# EAGLE design Main.v0.2 (EAGLE 7.4.0)

## Sheet 1 of 2
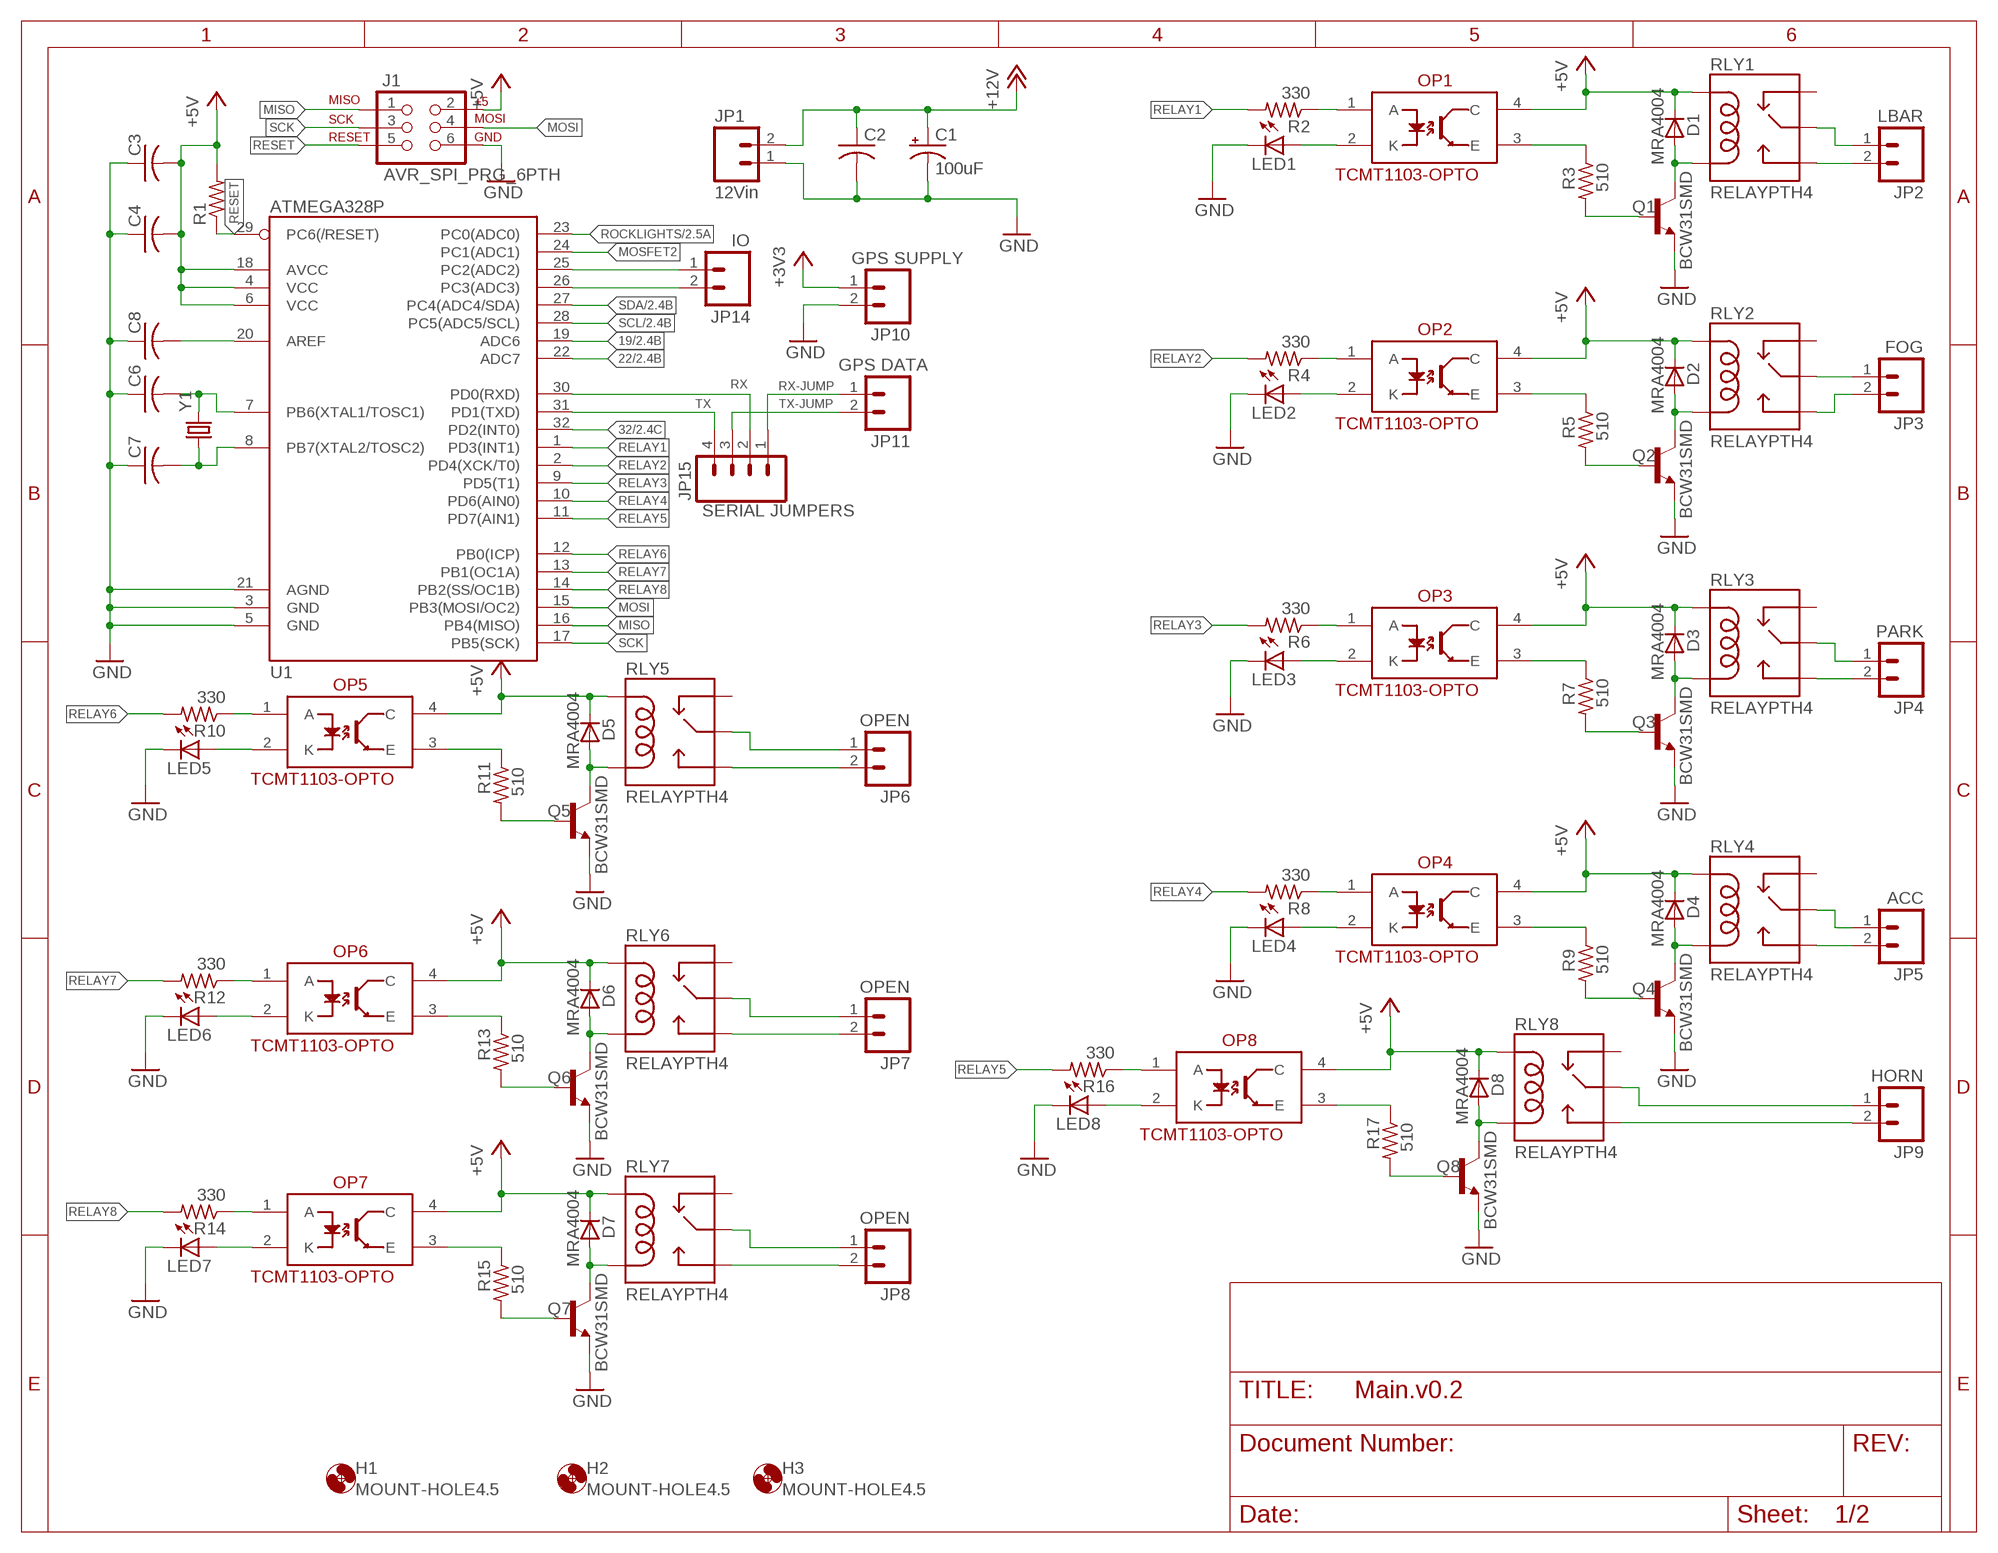
[diagram p0: schematic, sheet 1]

### Parts
C1  100uF  CPOL-USF  [PANASONIC_F]
C2  C-USC1206  [C1206]
C3  C-USC1206  [C1206]
C4  C-USC1206  [C1206]
C6  C-USC1206  [C1206]
C7  C-USC1206  [C1206]
C8  C-USC1206  [C1206]
D1  MRA4004  DIODESMA-ALT  [SMA-DIODE_ALT]
D2  MRA4004  DIODESMA-ALT  [SMA-DIODE_ALT]
D3  MRA4004  DIODESMA-ALT  [SMA-DIODE_ALT]
D4  MRA4004  DIODESMA-ALT  [SMA-DIODE_ALT]
D5  MRA4004  DIODESMA-ALT  [SMA-DIODE_ALT]
D6  MRA4004  DIODESMA-ALT  [SMA-DIODE_ALT]
D7  MRA4004  DIODESMA-ALT  [SMA-DIODE_ALT]
D8  MRA4004  DIODESMA-ALT  [SMA-DIODE_ALT]
H1  MOUNT-HOLE4.5  [4,5]
H2  MOUNT-HOLE4.5  [4,5]
H3  MOUNT-HOLE4.5  [4,5]
J1  AVR_SPI_PRG_6PTH  [2X3]
JP1  12Vin  M023.5MM  [SCREWTERMINAL-3.5MM-2]
JP2  LBAR  M023.5MM  [SCREWTERMINAL-3.5MM-2]
JP3  FOG  M023.5MM  [SCREWTERMINAL-3.5MM-2]
JP4  PARK  M023.5MM  [SCREWTERMINAL-3.5MM-2]
JP5  ACC  M023.5MM  [SCREWTERMINAL-3.5MM-2]
JP6  OPEN  M023.5MM  [SCREWTERMINAL-3.5MM-2]
JP7  OPEN  M023.5MM  [SCREWTERMINAL-3.5MM-2]
JP8  OPEN  M023.5MM  [SCREWTERMINAL-3.5MM-2]
JP9  HORN  M023.5MM  [SCREWTERMINAL-3.5MM-2]
JP10  GPS SUPPLY  M023.5MM  [SCREWTERMINAL-3.5MM-2]
JP11  GPS DATA  M023.5MM  [SCREWTERMINAL-3.5MM-2]
JP14  IO  M023.5MM  [SCREWTERMINAL-3.5MM-2]
JP15  SERIAL JUMPERS  M04PTH  [1X04]
LED1  LED1206  [LED-1206]
LED2  LED1206  [LED-1206]
LED3  LED1206  [LED-1206]
LED4  LED1206  [LED-1206]
LED5  LED1206  [LED-1206]
LED6  LED1206  [LED-1206]
LED7  LED1206  [LED-1206]
LED8  LED1206  [LED-1206]
OP1  TCMT1103-OPTO  [SSOP-4]
OP2  TCMT1103-OPTO  [SSOP-4]
OP3  TCMT1103-OPTO  [SSOP-4]
OP4  TCMT1103-OPTO  [SSOP-4]
OP5  TCMT1103-OPTO  [SSOP-4]
OP6  TCMT1103-OPTO  [SSOP-4]
OP7  TCMT1103-OPTO  [SSOP-4]
OP8  TCMT1103-OPTO  [SSOP-4]
Q1  BCW31SMD  [SOT23-BEC]
Q2  BCW31SMD  [SOT23-BEC]
Q3  BCW31SMD  [SOT23-BEC]
Q4  BCW31SMD  [SOT23-BEC]
Q5  BCW31SMD  [SOT23-BEC]
Q6  BCW31SMD  [SOT23-BEC]
Q7  BCW31SMD  [SOT23-BEC]
Q8  BCW31SMD  [SOT23-BEC]
R1  R-US_R1206  [R1206]
R2  330  R-US_R1206  [R1206]
R3  510  R-US_R1206  [R1206]
R4  330  R-US_R1206  [R1206]
R5  510  R-US_R1206  [R1206]
R6  330  R-US_R1206  [R1206]
R7  510  R-US_R1206  [R1206]
R8  330  R-US_R1206  [R1206]
R9  510  R-US_R1206  [R1206]
R10  330  R-US_R1206  [R1206]
R11  510  R-US_R1206  [R1206]
R12  330  R-US_R1206  [R1206]
R13  510  R-US_R1206  [R1206]
R14  330  R-US_R1206  [R1206]
R15  510  R-US_R1206  [R1206]
R16  330  R-US_R1206  [R1206]
R17  510  R-US_R1206  [R1206]
RLY1  RELAYPTH4  [RELAY-JZC]
RLY2  RELAYPTH4  [RELAY-JZC]
RLY3  RELAYPTH4  [RELAY-JZC]
RLY4  RELAYPTH4  [RELAY-JZC]
RLY5  RELAYPTH4  [RELAY-JZC]
RLY6  RELAYPTH4  [RELAY-JZC]
RLY7  RELAYPTH4  [RELAY-JZC]
RLY8  RELAYPTH4  [RELAY-JZC]
U1  ATMEGA328P  ATMEGA328_SMT  [TQFP32-08]
Y1  CRYSTALSMD  [HC49UP]

### Nets
19: U1.19(ADC6) ; also sheet 2
22: U1.22(ADC7) ; also sheet 2
32: U1.32(PD2(INT0)) ; also sheet 2
+3V3: JP10.1 ; also sheet 2
+5V: C3.2 C4.2 D1.C D2.C D3.C D4.C D5.C D6.C D7.C D8.C J1.2 OP1.4(C) OP2.4(C) OP3.4(C) OP4.4(C) OP5.4(C) OP6.4(C) OP7.4(C) OP8.4(C) R1.2 RLY1.5(COIL1) RLY2.5(COIL1) RLY3.5(COIL1) RLY4.5(COIL1) RLY5.5(COIL1) RLY6.5(COIL1) RLY7.5(COIL1) RLY8.5(COIL1) U1.4(VCC) U1.6(VCC) U1.18(AVCC) ; also sheet 2
+12V: C1.+ C2.1 JP1.2 ; also sheet 2
GND: C1.- C2.2 C3.1 C4.1 C6.1 C7.1 C8.1 J1.6 JP1.1 JP10.2 LED1.C LED2.C LED3.C LED4.C LED5.C LED6.C LED7.C LED8.C Q1.E Q2.E Q3.E Q4.E Q5.E Q6.E Q7.E Q8.E U1.3(GND) U1.5(GND) U1.21(AGND) ; also sheet 2
MISO: J1.1 U1.16(PB4(MISO))
MOSFET2: U1.24(PC1(ADC1))
MOSI: J1.4 U1.15(PB3(MOSI/OC2))
N$1: LED6.A OP6.2(K)
N$2: D1.A Q1.C RLY1.1(COIL2)
N$3: C6.2 U1.7(PB6(XTAL1/TOSC1)) Y1.2
N$4: C7.2 U1.8(PB7(XTAL2/TOSC2)) Y1.1
N$5: C8.2 U1.20(AREF)
N$6: Q1.B R3.2
N$7: OP1.3(E) R3.1
N$8: OP1.1(A) R2.1
N$9: LED1.A OP1.2(K)
N$10: D2.A Q2.C RLY2.1(COIL2)
N$11: Q2.B R5.2
N$12: OP2.3(E) R5.1
N$13: OP2.1(A) R4.1
N$14: LED2.A OP2.2(K)
N$15: D3.A Q3.C RLY3.1(COIL2)
N$16: Q3.B R7.2
N$17: OP3.3(E) R7.1
N$18: OP3.1(A) R6.1
N$19: LED3.A OP3.2(K)
N$20: D4.A Q4.C RLY4.1(COIL2)
N$21: Q4.B R9.2
N$22: OP4.3(E) R9.1
N$23: OP4.1(A) R8.1
N$24: LED5.A OP5.2(K)
N$25: D5.A Q5.C RLY5.1(COIL2)
N$26: Q5.B R11.2
N$27: OP5.3(E) R11.1
N$28: OP5.1(A) R10.1
N$29: LED4.A OP4.2(K)
N$30: D6.A Q6.C RLY6.1(COIL2)
N$31: Q6.B R13.2
N$32: OP6.3(E) R13.1
N$33: OP6.1(A) R12.1
N$34: LED7.A OP7.2(K)
N$35: D7.A Q7.C RLY7.1(COIL2)
N$36: Q7.B R15.2
N$37: OP7.3(E) R15.1
N$38: OP7.1(A) R14.1
N$39: LED8.A OP8.2(K)
N$40: D8.A Q8.C RLY8.1(COIL2)
N$41: Q8.B R17.2
N$42: OP8.3(E) R17.1
N$43: OP8.1(A) R16.1
N$44: JP8.2 RLY7.3(NO)
N$45: JP9.2 RLY8.3(NO)
N$46: JP8.1 RLY7.4(MAIN)
N$47: JP7.1 RLY6.4(MAIN)
N$48: JP7.2 RLY6.3(NO)
N$49: JP6.2 RLY5.3(NO)
N$50: JP6.1 RLY5.4(MAIN)
N$51: JP9.1 RLY8.4(MAIN)
N$52: JP5.2 RLY4.3(NO)
N$53: JP5.1 RLY4.4(MAIN)
N$54: JP4.2 RLY3.3(NO)
N$55: JP4.1 RLY3.4(MAIN)
N$56: JP3.2 RLY2.3(NO)
N$57: JP3.1 RLY2.4(MAIN)
N$58: JP2.2 RLY1.3(NO)
N$59: JP2.1 RLY1.4(MAIN)
N$63: JP14.2 U1.26(PC3(ADC3))
RELAY1: R2.2 U1.1(PD3(INT1))
RELAY2: R4.2 U1.2(PD4(XCK/T0))
RELAY3: R6.2 U1.9(PD5(T1))
RELAY4: R8.2 U1.10(PD6(AIN0))
RELAY5: R16.2 U1.11(PD7(AIN1))
RELAY6: R10.2 U1.12(PB0(ICP))
RELAY7: R12.2 U1.13(PB1(OC1A))
RELAY8: R14.2 U1.14(PB2(SS/OC1B))
RESET: J1.5 R1.1 U1.29(PC6(/RESET))
RFID: JP14.1 U1.25(PC2(ADC2))
ROCKLIGHTS: U1.23(PC0(ADC0)) ; also sheet 2
RX: JP15.2 U1.30(PD0(RXD)) ; also sheet 2
RX-JUMP: JP11.1 JP15.1
SCK: J1.3 U1.17(PB5(SCK))
SCL: U1.28(PC5(ADC5/SCL)) ; also sheet 2
SDA: U1.27(PC4(ADC4/SDA)) ; also sheet 2
TX: JP15.4 U1.31(PD1(TXD)) ; also sheet 2
TX-JUMP: JP11.2 JP15.3
Unconnected: RLY1.2(NC) RLY2.2(NC) RLY3.2(NC) RLY4.2(NC) RLY5.2(NC) RLY6.2(NC) RLY7.2(NC) RLY8.2(NC)

## Sheet 2 of 2
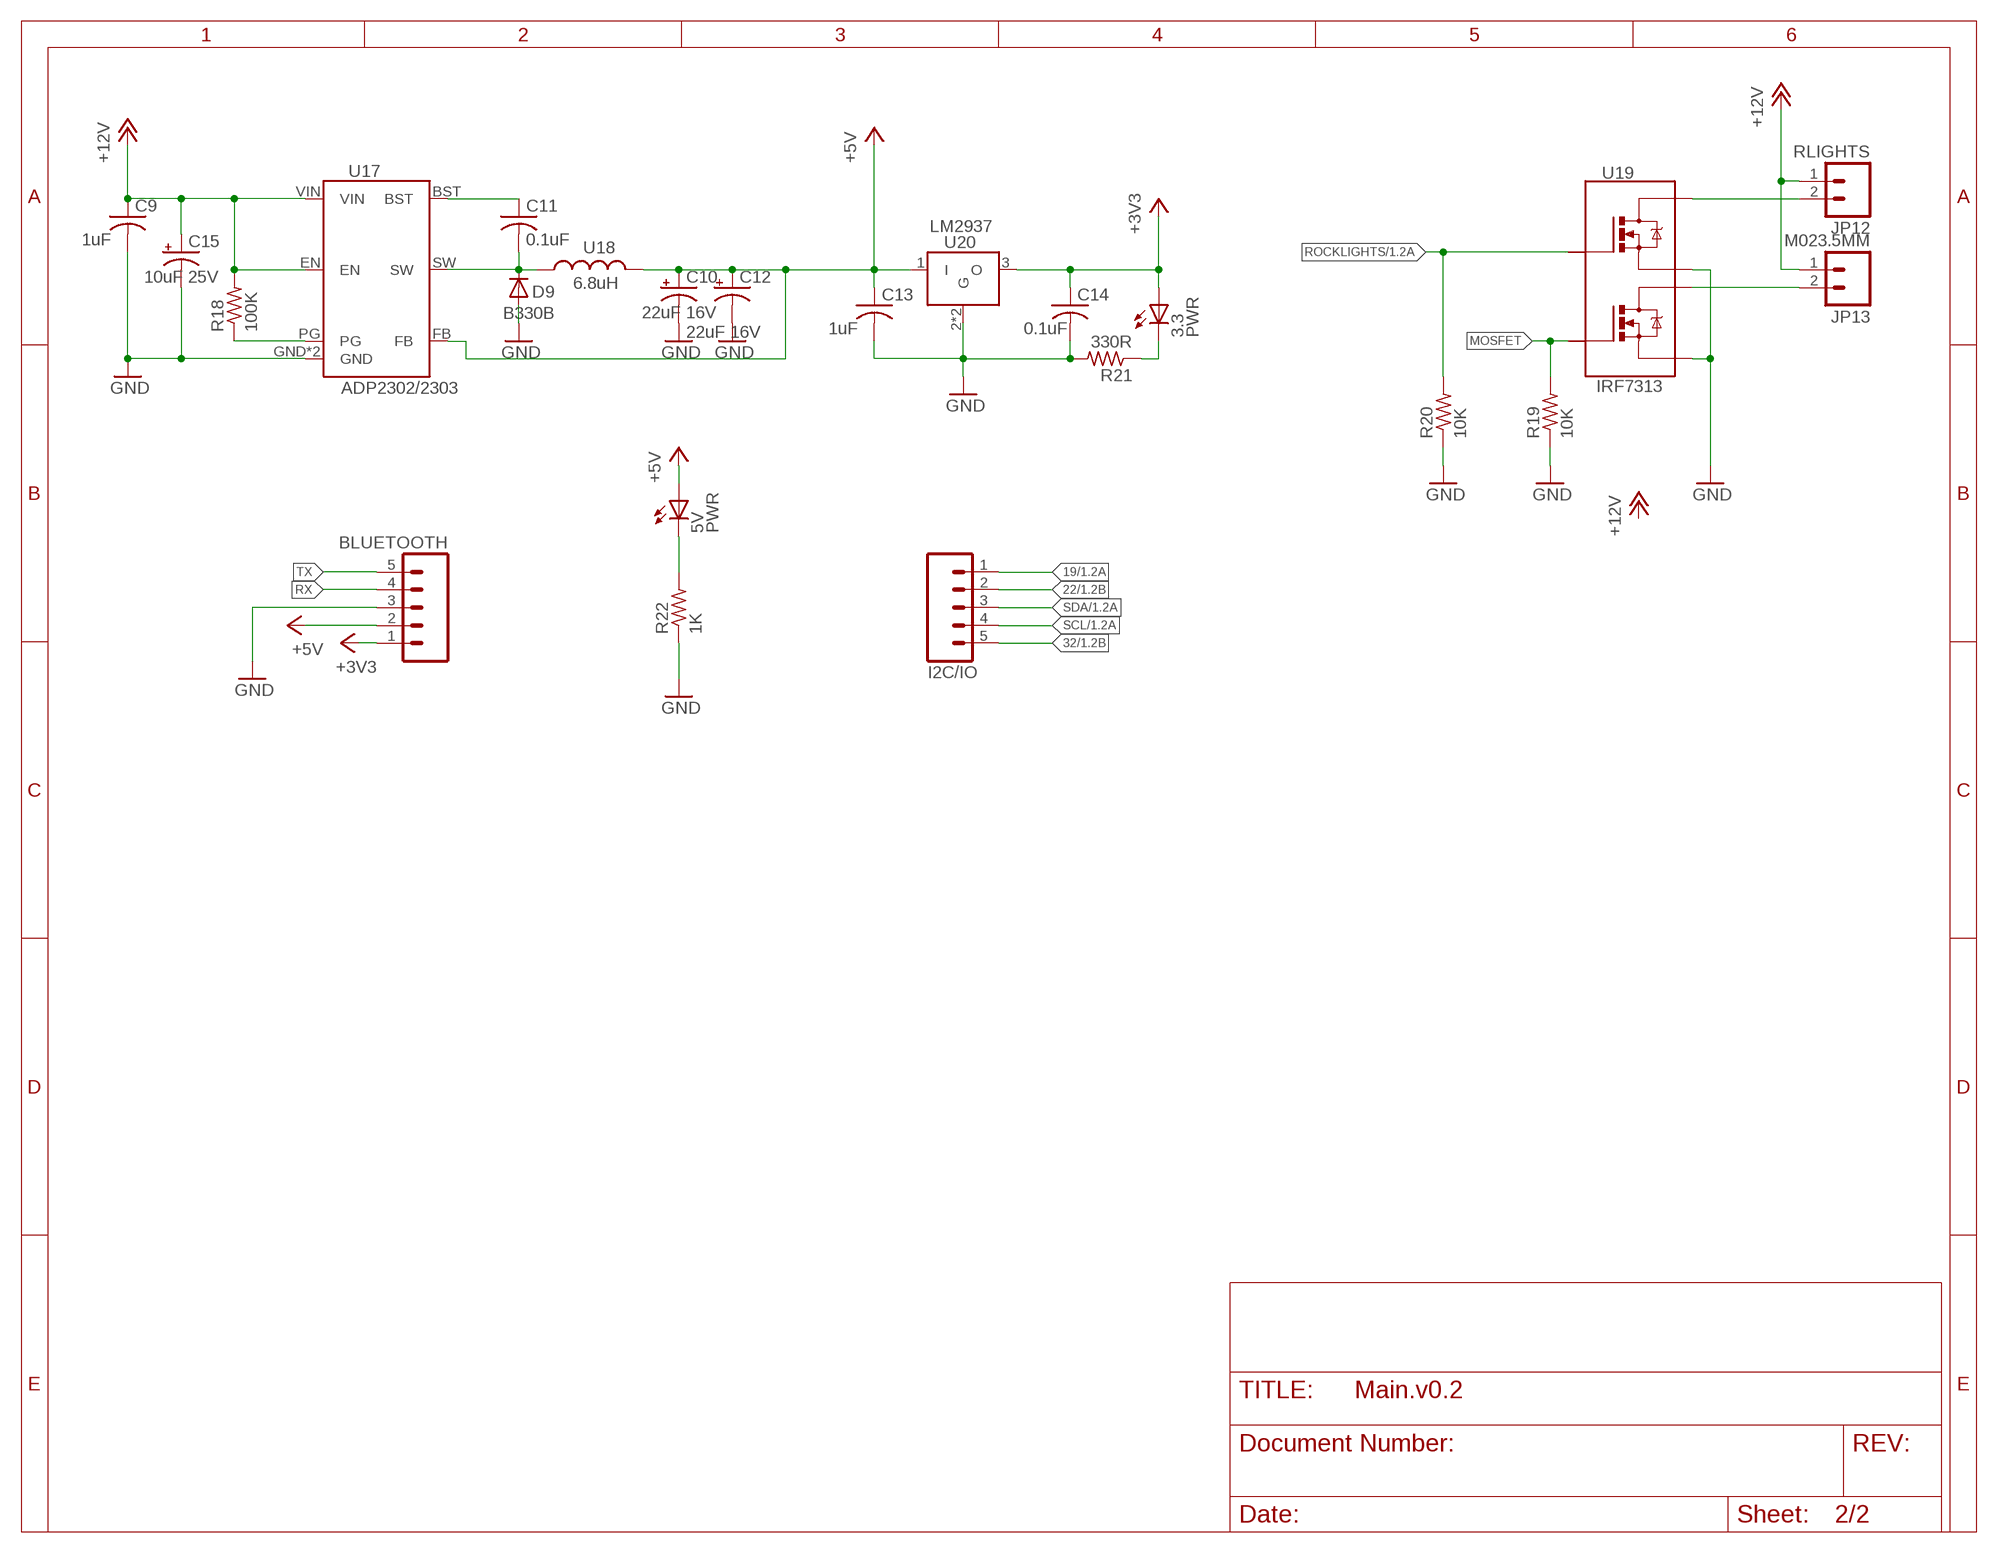
[diagram p1: schematic, sheet 2]

### Parts
3.3  PWR  LED1206  [LED-1206]
5V  PWR  LED1206  [LED-1206]
BLUETOOTH  M05PTH  [1X05]
C9  1uF  C-USC1206  [C1206]
C10  22uF 16V  CPOL-USE  [PANASONIC_E]
C11  0.1uF  C-USC1206  [C1206]
C12  22uF 16V  CPOL-USE  [PANASONIC_E]
C13  1uF  C-USC1206  [C1206]
C14  0.1uF  C-USC1206  [C1206]
C15  10uF 25V  CPOL-USE  [PANASONIC_E]
D9  B330B  DIODE-DO214AA  [DO214AA]
I2C/IO  M05PTH  [1X05]
JP12  RLIGHTS  M023.5MM  [SCREWTERMINAL-3.5MM-2]
JP13  M023.5MM  [SCREWTERMINAL-3.5MM-2]
R18  100K  R-US_R1206  [R1206]
R19  10K  R-US_R1206  [R1206]
R20  10K  R-US_R1206  [R1206]
R21  330R  R-US_R1206  [R1206]
R22  1K  R-US_R1206  [R1206]
U17  ADP2302/2303  [8SOIC]
U18  6.8uH  INDUCTOR  [INDUCTOR]
U19  IRF7313  [SO-8]
U20  LM2937  [SOT223]

### Nets
19: I2C/IO.1 ; also sheet 1
22: I2C/IO.2 ; also sheet 1
32: I2C/IO.5 ; also sheet 1
+3V3: 3.3.A BLUETOOTH.1 C14.1 U20.3(O) ; also sheet 1
+5V: 5V.A BLUETOOTH.2 C10.+ C12.+ C13.1 U17.FB U18.P$2 U20.1(I) ; also sheet 1
+12V: C9.1 C15.+ JP12.1 JP13.1 R18.2 U17.EN U17.VIN ; also sheet 1
GND: BLUETOOTH.3 C9.2 C10.- C12.- C13.2 C14.2 C15.- D9.A R19.1 R20.1 R21.2 R22.1 U17.GND U17.NC(GND) U19.1(S) U19.3(S1) U20.2(G) U20.4(G) ; also sheet 1
MOSFET: R19.2 U19.4(G1)
N$60: JP12.2 U19.7(D) U19.8(D)
N$61: JP13.2 U19.5(D1) U19.6(D1)
N$62: R18.1 U17.PG
N$64: 3.3.C R21.1
N$65: C11.1 U17.BST
N$67: 5V.C R22.2
ROCKLIGHTS: R20.2 U19.2(G) ; also sheet 1
RX: BLUETOOTH.4 ; also sheet 1
SCL: I2C/IO.4 ; also sheet 1
SDA: I2C/IO.3 ; also sheet 1
SW: C11.2 D9.C U17.SW U18.P$1
TX: BLUETOOTH.5 ; also sheet 1

## Library data of the parts
3.3 5V LED1-LED8 = SparkFun-LED:LED: LEDs Standard schematic elements and footprints for 5mm, 3mm, 1206, and 0603 sized LEDs. 5mm - Spark Fun Electronics SKU : COM-00529 (and others)
BLUETOOTH I2C/IO = SparkFun-Connectors:M05: Header 5 Standard 5-pin 0.1" header. Use with straight break away headers (SKU : PRT-00116), right angle break away headers (PRT-00553), swiss pins (PRT-00743), machine pins (PRT-00117), and female headers (PRT-00115). Molex polarized connector foot print use with SKU : PRT-08230 with associated crimp pins and housings.
C1 C10 C12 C15 = rcl:CPOL-US: POLARIZED CAPACITOR, American symbol
C2-C4 C6-C9 C11 C13 C14 = rcl:C-US: CAPACITOR, American symbol
D1-D8 = SparkFun-DiscreteSemi:DIODE: Diode These are standard reverse protection diodes and small signal diodes. SMA package can handle up to about 1A. SOD-323 can handle about 200mA. What the SOD-323 package when ordering, there are some mfgs out there that are 5-pin packages.
D9 = diode:DIODE-: DIODE
H1-H3 = holes:MOUNT-HOLE: MOUNTING HOLE with drill center marker
J1 = SparkFun-Connectors:AVR_SPI_PRG_6: AVR ISP 6 Pin This is the reduced ISP connector for AVR programming. Common on Arduino. This footprint will take up less PCB space and can be used with a 10-pin to 6-pin adapter such as SKU: BOB-08508
JP1-JP14 = SparkFun-Connectors:M02: Standard 2-pin 0.1" header. Use with - straight break away headers ( PRT-00116) - right angle break away headers (PRT-00553) - swiss pins (PRT-00743) - machine pins (PRT-00117) - female headers (PRT-00115) Molex polarized connector foot print use with: PRT-08233 with associated crimp pins and housings. 2.54_SCREWTERM for use with PRT-10571. 3.5mm Screw Terminal footprints for PRT-08084 5mm Screw Terminal footprints for use with PRT-08433
JP15 = SparkFun-Connectors:M04: Header 4 Standard 4-pin 0.1" header. Use with straight break away headers (SKU : PRT-00116), right angle break away headers (PRT-00553), swiss pins (PRT-00743), machine pins (PRT-00117), and female headers (PRT-00115). Molex polarized connector foot print use with SKU : PRT-08231 with associated crimp pins and housings. 1MM SMD Version SKU: PRT-10208
OP1-OP8 = SparkFun-DiscreteSemi:TCMT1103-OPTO: Optoisolator- NPN output
Q1-Q8 = transistor-npn:BCW31*: NPN Transistor
R1-R22 = rcl:R-US_: RESISTOR, American symbol
RLY1-RLY8 = SparkFun-Electromechanical:RELAY: SPDT relay (COM-00101)
U1 = SparkFun-DigitalIC:ATMEGA328_SMT: 32-Pin Atmega328 part Commonly used on Arduino compatible boards Available in QFP and QFN packages TQFP is IC-09069 QFN is non-stock; PROD_ID: IC-09069
U17 = Custom:ADP2302/2303
U18 = Custom:INDUCTOR
U19 = Custom:IRF7313: IRF7313 - Logic Level MOSFET
U20 = Custom:LM2937: LM2937-3.3 - 3.3V LDO Regulator
Y1 = SparkFun-FreqCtrl:CRYSTAL: Various standard crystals. Proven footprints. Spark Fun Electronics SKU : COM-00534

## Board
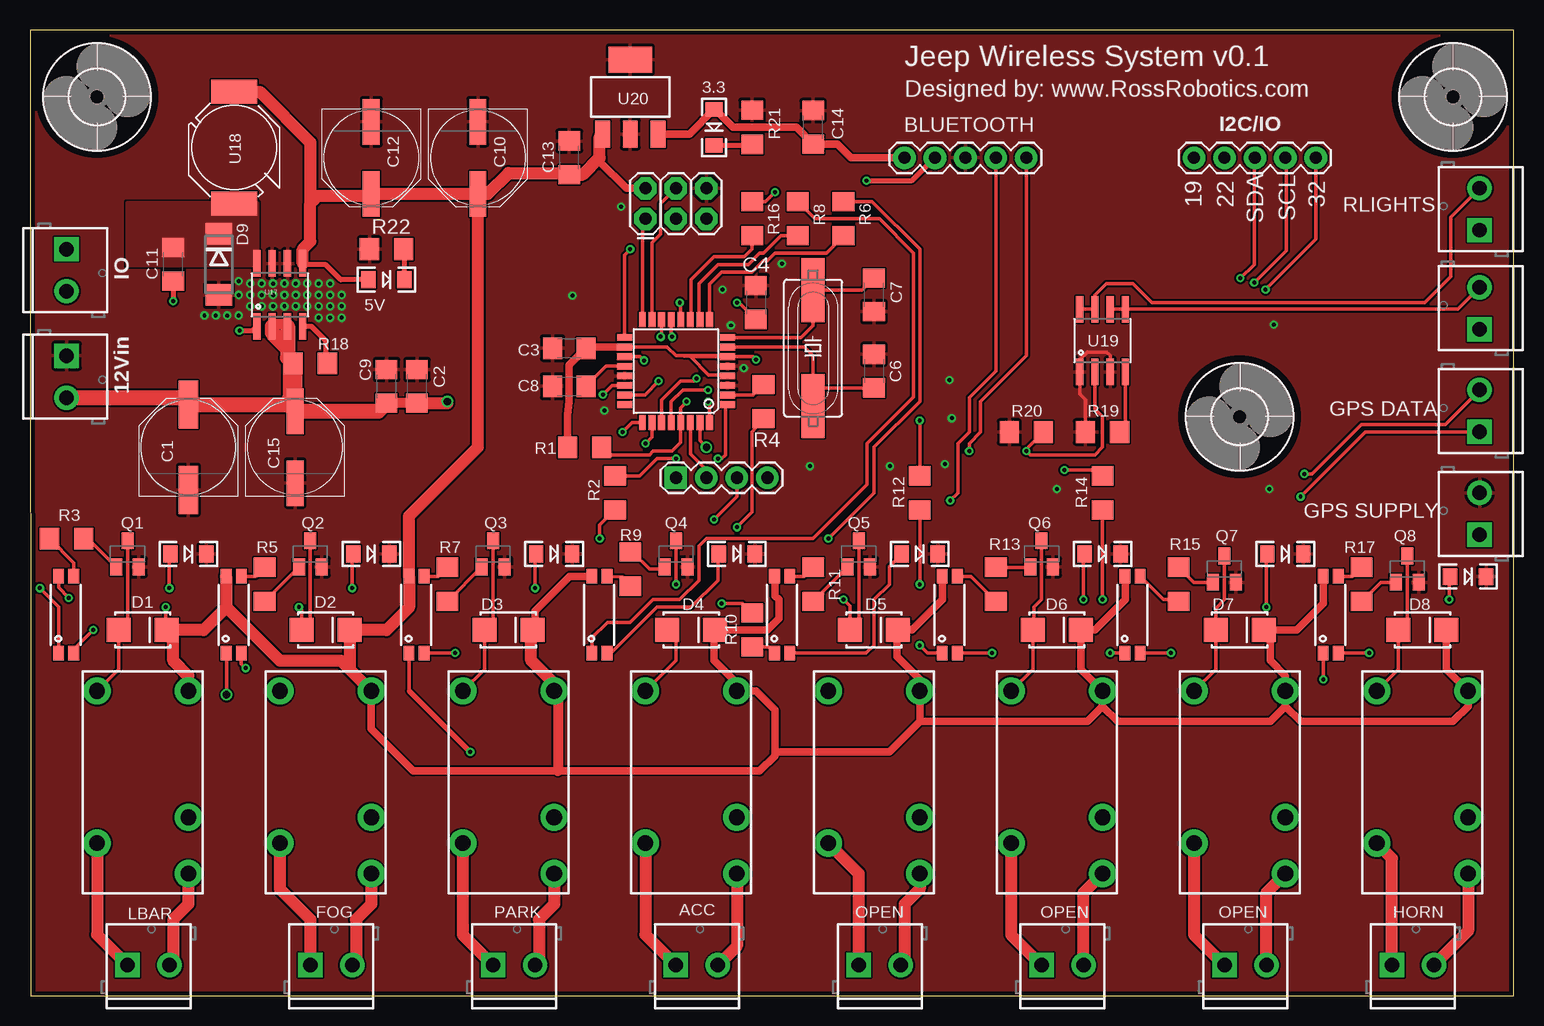
[diagram p2: board, top side]
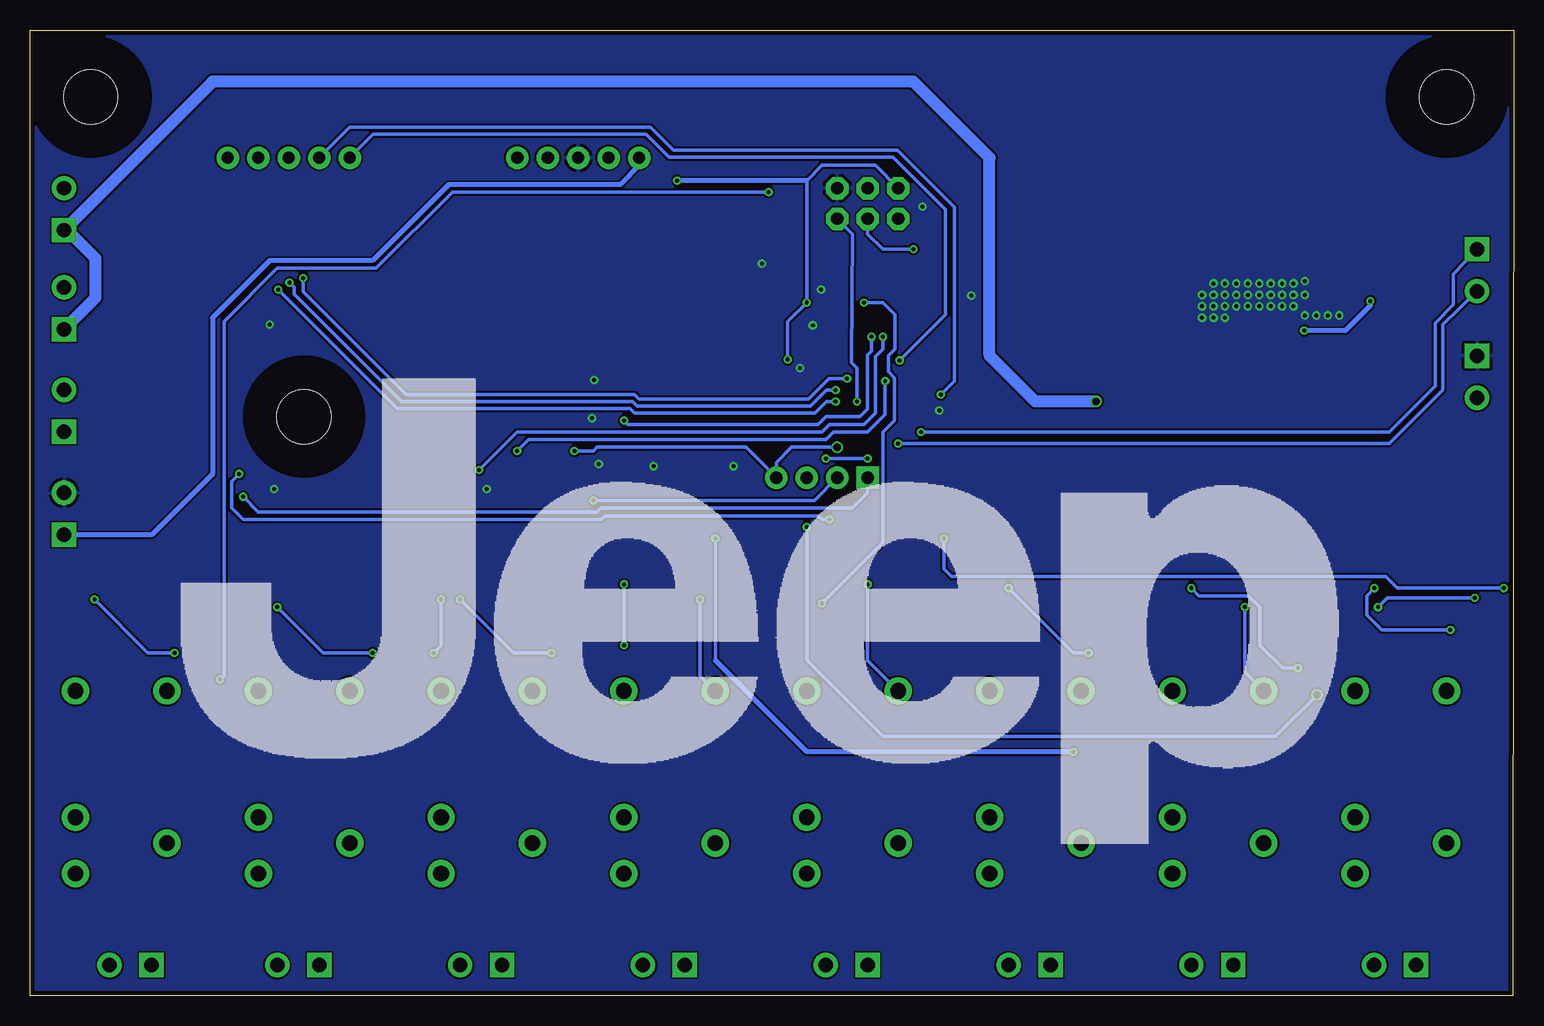
[diagram p3: board, bottom side, seen from below]

Size 123.68 x 80.51 mm. Coordinates in mm from the lower left corner, seen from the top.
Outline: 0.07,0 123.68,0 123.68,80.5 0,80.5 0.07,0
Copper layers (1*16): Top 0.0356mm / dielectric 1.5011mm / Bottom 0.0356mm
Design rules "LaenPCBOrder": minimum track width 6mil, minimum drill 13mil, track to track 6mil, track to pad 6mil, pad to pad 6mil, via to via 6mil, smd to smd 6mil, copper to edge 15mil, drill to drill 6mil, minimum pad ring 7mil, minimum via ring 7mil, stop-mask expansion 4mil, vias tented up to drill 0mil, thermal gap 10mil

### Footprints (pad centres in the part's own frame; a part is rotated, then mirrored left to right if it is on the bottom)
LED-1206 = smd 1.2 x 1.4: A -1.5,0; C 1.5,0
1X05 = drill 1.016 pad 1.88: 1 0,0; 2 2.54,0; 3 5.08,0; 4 7.62,0; 5 10.16,0
PANASONIC_F = smd 4 x 1.6: + 3.55,0; - -3.55,0
C1206 = smd 1.6 x 1.8: 1 -1.4,0; 2 1.4,0
PANASONIC_E = smd 3.8 x 1.4: + 3,0; - -3,0
SMA-DIODE_ALT = smd 2 x 2: A -2,0; C 2,0
DO214AA = smd 1.8 x 2.2: A 2.55,0; C -2.55,0
4,5 = hole 4.5: 0,0
2X3 = drill 1.016 pad 1.88 octagon: 1 0,0; 2 0,2.54; 3 2.54,0; 4 2.54,2.54; 5 5.08,0; 6 5.08,2.54
SCREWTERMINAL-3.5MM-2 = drill 1.2 pad 2.032 square: 1 0,0 | drill 1.2 pad 2.032: 2 3.5,0
1X04 = drill 1.016 pad 1.88 square: 1 0,0 | drill 1.016 pad 1.88: 2 2.54,0; 3 5.08,0; 4 7.62,0
SSOP-4 = smd 1.2 x 0.9: 1 -3.2,0.67; 2 -3.2,-0.6; 3 3.2,-0.6; 4 3.2,0.67
SOT23-BEC = smd 1 x 1.4: B -0.95,-1.1; C 0,1.1; E 0.95,-1.1
R1206 = smd 1.6 x 1.803: 1 -1.422,0; 2 1.422,0
RELAY-JZC = drill 1.3 pad 2.286: 1 3.81,-8.89; 2 -3.81,1.651; 3 -3.81,6.35; 4 3.81,3.81; 5 -3.81,-8.89
TQFP32-08 = smd 1.27 x 0.559: 1 -4.293,2.8; 2 -4.293,2; 3 -4.293,1.2; 4 -4.293,0.4; 5 -4.293,-0.4; 6 -4.293,-1.2; 7 -4.293,-2; 8 -4.293,-2.8; 17 4.293,-2.8; 18 4.293,-2; 19 4.293,-1.2; 20 4.293,-0.4; 21 4.293,0.4; 22 4.293,1.2; 23 4.293,2; 24 4.293,2.8 | smd 0.559 x 1.27: 9 -2.8,-4.293; 10 -2,-4.293; 11 -1.2,-4.293; 12 -0.4,-4.293; 13 0.4,-4.293; 14 1.2,-4.293; 15 2,-4.293; 16 2.8,-4.293; 25 2.8,4.293; 26 2,4.293; 27 1.2,4.293; 28 0.4,4.293; 29 -0.4,4.293; 30 -1.2,4.293; 31 -2,4.293; 32 -2.8,4.293
8SOIC = smd 0.61 x 2.21: BST -1.905,-2.616; EN 0.635,-2.616; FB 1.905,2.616; GND -0.635,2.616; NC 0.635,2.616; PG 1.905,-2.616; SW -1.905,2.616; VIN -0.635,-2.616
INDUCTOR = smd 2 x 3.8: P$1 -5.08,0; P$2 4.22,0
SO-8 = smd 0.61 x 2.21: 1 -1.905,-2.616; 2 -0.635,-2.616; 3 0.635,-2.616; 4 1.905,-2.616; 5 1.905,2.616; 6 0.635,2.616; 7 -0.635,2.616; 8 -1.905,2.616
SOT223 = smd 1.219 x 2.235: 1 -2.311,-3.099; 2 0,-3.099; 3 2.311,-3.099 | smd 3.6 x 2.2: 4 0,3.099
HC49UP = smd 5.334 x 1.93: 1 -4.826,0; 2 4.826,0

### Placement (x,y rotation side)
3.3  57.02,72.39 270 top
5V  29.72,59.69 0 top
BLUETOOTH  72.9,69.85 0 top
C1  13.21,45.72 90 top
C2  32.26,50.8 90 top
C3  44.96,53.98 0 top
C4  60.52,57.78 270 top
C6  70.36,52.07 270 top
C7  70.36,58.42 90 top
C8  44.96,50.8 0 top
C9  29.72,50.8 90 top
C10  37.34,69.85 270 top
C11  11.94,60.96 90 top
C12  28.45,69.85 270 top
C13  44.96,69.85 90 top
C14  65.28,72.39 90 top
C15  22.1,45.72 90 top
D1  9.4,30.48 0 top
D2  24.64,30.48 0 top
D3  39.88,30.48 0 top
D4  55.12,30.48 0 top
D5  70.36,30.48 0 top
D6  85.6,30.48 0 top
D7  100.84,30.48 0 top
D8  116.08,30.48 0 top
D9  15.75,60.96 270 top
H1  5.59,74.93 0 top
H2  118.62,74.93 0 top
H3  100.84,48.26 0 top
I2C/IO  97.03,69.85 0 top
J1  51.31,64.77 0 top
JP1  3.05,53.34 270 top
JP2  8.13,2.54 0 top
JP3  23.37,2.54 0 top
JP4  38.61,2.54 0 top
JP5  53.85,2.54 0 top
JP6  69.09,2.54 0 top
JP7  84.33,2.54 0 top
JP8  99.57,2.54 0 top
JP9  113.54,2.54 0 top
JP10  120.84,38.42 90 top
JP11  120.84,46.99 90 top
JP12  120.84,63.82 90 top
JP13  120.84,55.56 90 top
JP14  3.05,62.23 270 top
JP15  53.85,43.18 0 top
LED1  13.21,36.83 0 top
LED2  28.45,36.83 0 top
LED3  43.69,36.83 0 top
LED4  58.93,36.83 0 top
LED5  74.17,36.83 0 top
LED6  89.41,36.83 0 top
LED7  104.65,36.83 0 top
LED8  119.89,34.92 0 top
OP1  3.05,31.75 90 top
OP2  17.02,31.75 90 top
OP3  32.26,31.75 90 top
OP4  47.5,31.75 90 top
OP5  62.74,31.75 90 top
OP6  76.71,31.75 90 top
OP7  91.95,31.75 90 top
OP8  108.46,31.75 90 top
Q1  8.13,36.83 0 top
Q2  23.37,36.83 0 top
Q3  38.61,36.83 0 top
Q4  53.85,36.83 0 top
Q5  69.09,36.83 0 top
Q6  84.33,36.83 0 top
Q7  99.57,35.56 0 top
Q8  114.81,35.56 0 top
R1  46.23,45.72 180 top
R2  48.77,41.91 90 top
R3  3.05,38.1 0 top
R4  61.15,49.53 90 top
R5  19.56,34.29 270 top
R6  67.82,64.77 270 top
R7  34.8,34.29 270 top
R8  64.01,64.77 270 top
R9  50.04,35.56 90 top
R10  60.2,30.48 90 top
R11  65.28,34.29 270 top
R12  74.17,41.91 90 top
R13  80.52,34.29 90 top
R14  89.41,41.91 90 top
R15  95.76,34.29 90 top
R16  60.2,64.77 270 top
R17  111,34.29 270 top
R18  23.37,52.7 180 top
R19  89.41,46.99 0 top
R20  83.06,46.99 0 top
R21  60.2,72.39 90 top
R22  29.72,62.23 0 top
RLY1  9.4,16.51 180 top
RLY2  24.64,16.51 180 top
RLY3  39.88,16.51 180 top
RLY4  55.12,16.51 180 top
RLY5  70.36,16.51 180 top
RLY6  85.6,16.51 180 top
RLY7  100.84,16.51 180 top
RLY8  116.08,16.51 180 top
U1  53.85,52.07 180 top
U17  20.83,58.42 0 top
U18  17.02,71.12 90 top
U19  89.41,54.61 0 top
U20  50.04,74.93 0 top
Y1  65.28,53.98 270 top

### Tracks (layer width: path | path; a pad name or v marks a point on that pad's centre or on a via)
19  (via drill 0.33)
  Top 0.305: U1.19 50.87,53.27 v51.18,52.96
  Bottom 0.305: v51.18,52.96 47.37,56.77 47.37,65.53 51.75,69.91 70.42,69.91 72.33,71.82 95.06,71.82 I2C/IO.1
22  (via drill 0.33)
  Top 0.305: U1.22 48.52,50.87 v47.75,50.1
  Bottom 0.305: v47.75,50.1 46.61,51.24 46.61,65.72 51.37,70.48 70.04,70.48 71.95,72.39 97.03,72.39 I2C/IO.2
32  (via drill 0.33)
  Top 0.305: U1.32 56.65,49.4 v56.52,49.53 | v103,58.86 107.19,63.06 I2C/IO.5
  Bottom 0.305: v56.52,49.53 57.28,49.53 58.23,48.58 73.28,48.58 73.66,48.96 93.09,48.96 v103,58.86
+3V3
  Top 0.61: U20.3 54.96,71.83 3.3.A 57.11,73.89 58.61,72.39 63.88,72.39 C14.1 67.31,70.99 68.45,69.85 BLUETOOTH.1
  Bottom 0.406: BLUETOOTH.1 72.9,69.22 74.49,67.63 88.77,67.63 95.12,61.28 103.7,61.28 108.46,56.52 108.46,43.5 113.54,38.42 JP10.1
+5V  (via drill 0.33)
  Top 0.305: 46.45,54.07 C3.2 | U1.18 53.12,54.07 53.85,53.34 | 53.85,53.34 58.07,53.34 U1.6 | U1.6 55.06,53.27 | 55.06,53.27 53.85,53.34 | 55.06,53.27 56.58,51.75 58.06,51.75 U1.4 | U1.6 60.27,53.27 v60.52,53.02 | v58.93,57.78 59.12,57.78 C4.2 | R1.2 45.09,45.72 | 42.1,30.7 D3.C | OP1.4 2.38,34.01 v3.24,33.15 | v11.3,32.38 11.3,30.57 D1.C
  Top 0.406: v69.72,67.94 73.53,67.94 BLUETOOTH.2 | 5V.A 25.91,59.69 24.64,60.96 22.81,60.96 U17.FB
  Top 0.61: U1.18 46.45,54.07 | R1.2 44.81,48.41 44.96,49.53 44.96,52.58 C3.2 | 47.5,69.85 47.5,69.53 49.72,67.31 J1.2 | OP4.4 44.98,34.95 42.1,32.07 42.1,30.7 | 62.1,20.32 62.1,23.81 60.52,25.4 RLY4.5 58.93,26.04 57.02,27.94 57.02,30.39 D4.C 61.47,30.48 62.42,31.43 62.42,33.02 62.1,33.34 62.1,34.91 OP5.4 | 62.1,20.32 62.1,20 60.83,18.73 44.01,18.73 31.94,18.73 28.45,22.23 RLY2.5 | 74.17,22.86 RLY5.5 74.17,26.35 72.26,28.26 72.26,30.39 D5.C 73.53,30.48 76.07,33.02 76.07,34.91 OP6.4 | 74.17,22.86 71.63,20.32 62.1,20.32 | 89.41,24.13 RLY6.5 87.6,27.21 D6.C 88.77,30.48 91.31,33.02 91.31,34.91 OP7.4 | 89.41,24.13 88.14,22.86 74.17,22.86 | 104.65,24.13 RLY7.5 104.65,26.67 103.38,27.94 103.38,29.94 D7.C 105.6,30.48 107.82,32.7 107.82,34.91 OP8.4 | 104.65,24.13 103.38,22.86 90.68,22.86 89.41,24.13 | 104.65,24.13 105.92,22.86 118.62,22.86 119.89,24.13 RLY8.5 118.08,27.21 D8.C
  Top 0.813: 41.78,27.94 44.01,25.72 44.01,18.73
  Top 1.016: U18.P$2 19.15,75.34 23.37,71.12 23.37,66.04 | U17.FB 22.73,62.23 23.37,62.87 23.37,66.04 | 23.37,66.04 24,66.67 28.27,66.67 C12.+ C10.+ | C10.+ 38.15,66.85 39.88,68.58 44.83,68.58 C13.1 46.1,68.45 47.5,69.85 47.5,71.6 U20.1 | C10.+ 37.34,45.72 31.59,39.97 OP3.4 31.59,32.35 29.72,30.48 D2.C 26.64,27.21 RLY2.5 25.91,27.94 20.83,27.94 16.35,32.42 OP2.4 16.35,32.35 14.48,30.48 11.94,30.48 | 11.94,30.48 D1.C | RLY3.5 43.69,26.04 41.78,27.94 41.78,30.39 D3.C | RLY1.5 13.21,26.67 11.94,27.94 11.94,30.48
  Bottom 0.305: v60.52,53.02 60.52,56.2 v58.93,57.78 58.93,67.94 57.66,69.22 53.21,69.22 J1.2 | v3.24,33.15 10.54,33.15 v11.3,32.38
  Bottom 0.406: 58.93,67.94 v69.72,67.94
+12V  (via drill 0.6)
  Top 0.61: 21.46,53.19 R18.2
  Top 0.813: C2.1 C9.1 | 20.32,56.01 21.46,56.01 U17.EN | 21.46,54.61 21.46,49.91
  Top 1.016: C2.1 34.8,49.4 v34.8,49.53
  Top 1.27: U17.EN 21.46,54.61 | 21.46,54.61 21.46,53.19 | JP1.2 12.64,49.84 C1.+ 21.55,49.27 C15.+ | C15.+ 29.04,48.72 C9.1 | C15.+ 22.1,52.55 R18.2 | U17.VIN 20.19,55.24 21.4,54.04 21.46,54.61
  Bottom 1.016: v34.8,49.53 39.88,49.53 43.69,53.34 43.69,69.85 50.04,76.2 108.46,76.2 JP12.1 120.59,63.82 118.24,61.47 118.24,58.17 JP13.1
GND  (via drill 0.33)
  Top 0.305: R19.1 87.99,49.68 87.5,50.16 U19.1 87.5,53.02 88.14,53.66 89.73,53.66 90.04,53.34 U19.3
  other vias: 76.64,51.31 59.5,52.32 58.42,55.88 57.72,58.86 62.67,61.02 22.16,59.37 22.16,58.42 22.16,57.47 21.21,57.47 21.21,58.42 21.21,59.37 20.26,59.37 20.26,58.42 20.26,57.47 19.3,57.47 19.3,58.42 19.3,59.37 18.35,59.37 18.35,58.42 18.35,57.47 17.4,58.42 17.4,59.56 49.28,65.79 47.88,48.77 17.4,56.71 16.45,56.71 15.49,56.71 14.54,56.71 23.11,57.47 23.11,58.42 23.11,59.37 24.07,59.37 24.07,58.42 24.07,57.47 24.07,56.52 25.02,59.37 25.02,58.42 25.02,57.47 25.02,56.52 25.97,56.52 25.97,57.47 25.97,58.42 76.83,48.13 76.26,44.32 71.69,44.13 65.02,44.13 85.6,42.23 103.31,42.23 103.7,55.94 45.21,58.36
  pour Top (rank 4): 0,80.45 123.7,80.26 123.89,-0.13 0,0.06
  pour Bottom: 0,80.33 123.7,80.52 123.89,-0.06 0,0.06
MISO
  Top 0.305: U1.16 51.05,64.51 J1.1
MOSFET
  Top 0.305: U19.4 91.31,47.47 R19.2
MOSI
  Top 0.305: U1.15 51.85,62.77 52.58,63.5 52.58,66.04 J1.4
N$1  (via drill 0.33)
  Top 0.305: OP6.2 80.18,28.55 v80.2,28.57 | v87.82,33.02 87.82,36.74 LED6.A
  Bottom 0.305: v80.2,28.57 83.38,28.57 v87.82,33.02
N$2
  Top 0.305: Q1.C 8.13,31.21 D1.A 7.4,27.21 RLY1.1
N$3
  Top 0.305: U1.7 64.55,54.07 65.28,53.34 65.28,50.8 | 65.28,50.8 Y1.2 | C6.2 65.41,50.67 65.28,50.8
N$4
  Top 0.305: U1.8 64.27,54.87 65.28,55.88 Y1.1 69.34,58.8 C7.2
N$5
  Top 0.305: U1.20 48.03,52.47 C8.2
N$6
  Top 0.305: R3.2 4.81,38.1 Q1.B
N$7
  Top 0.305: OP1.3 3.65,36.08 R3.1
N$8  (via drill 0.33)
  Top 0.305: OP1.1 2.38,32.42 v0.83,33.97 | v47.5,38.1 47.5,39.22 R2.1
  Bottom 0.305: v0.83,33.97 9.71,33.97 10.67,34.92 46.86,34.92 47.5,35.56 v47.5,38.1
N$9  (via drill 0.33)
  Top 0.305: OP1.2 3.65,28.86 v5.27,30.48 | v11.62,33.97 11.62,36.74 LED1.A
  Bottom 0.305: v5.27,30.48 10.98,30.48 12.26,31.75 12.26,33.34 v11.62,33.97
N$10  (via drill 0.33)
  Top 0.305: Q2.C 23.37,31.21 D2.A 22.64,32.16 v22.41,32.38
  Bottom 0.305: v22.41,32.38 22.41,26.99 RLY2.1
N$11
  Top 0.305: R5.2 Q2.B
N$12
  Top 0.305: OP2.3 18.8,34.95 R5.1
N$13  (via drill 0.33, 0.6)
  Top 0.305: R4.1 60.2,46.99 60.2,40.32 v58.93,39.05 | v16.38,25.08 16.38,28.52 OP2.1
  Bottom 0.305: v58.93,39.05 58.93,27.94 52.58,21.59 19.88,21.59 v16.38,25.08
N$14  (via drill 0.33)
  Top 0.305: OP2.2 17.62,27.66 v17.97,27.3 | v26.86,33.97 26.86,36.74 LED2.A
  Bottom 0.305: v17.97,27.3 19.24,27.3 21.14,29.21 21.14,32.38 22.1,33.34 26.23,33.34 v26.86,33.97
N$15
  Top 0.305: Q3.C 38.61,31.21 D3.A 37.88,27.21 RLY3.1
N$16
  Top 0.305: R7.2 Q3.B
N$17
  Top 0.305: OP3.3 34.04,34.95 R7.1
N$18  (via drill 0.33)
  Top 0.305: R6.1 70.21,66.19 74.17,62.23 74.17,49.53 70.36,45.72 70.36,41.91 v66.55,38.1 | 31.62,25.4 31.62,28.52 OP3.1
  Top 0.406: 31.62,25.4 v36.7,20.32
  Bottom 0.305: v66.55,38.1 66.55,27.94
  Bottom 0.406: 66.55,27.94 58.93,20.32 v36.7,20.32
N$19  (via drill 0.33)
  Top 0.305: OP3.2 35.41,28.55 v35.43,28.57 | v42.1,33.97 42.1,36.74 LED3.A
  Bottom 0.305: v35.43,28.57 36.7,28.57 v42.1,33.97
N$20  (via drill 0.33)
  Top 0.305: 53.85,38.1 Q4.C v53.85,34.29 | D4.A 53.85,30.48 53.85,27.94 RLY4.1
  Bottom 0.305: v53.85,34.29 53.85,27.94 RLY4.1
N$21
  Top 0.305: R9.2 50.2,36.98 51.62,35.56 52.73,35.56 Q4.B
N$22
  Top 0.305: R9.1 49.4,34.91 OP4.3
N$23
  Top 0.305: 64.49,66.19 R8.1 65.43,64.77 70.8,64.77 73.66,61.91 73.66,49.91 69.79,46.04 69.79,42.61 65.28,38.1 56.39,38.1 55.75,37.47 55.75,34.61 54.16,33.02 51.94,33.02 50.04,31.11 48.13,31.11 46.86,29.84 46.86,28.59 OP4.1
N$24
  Top 0.305: OP5.2 69.7,28.55 70.36,29.21 70.36,33.02 71.63,34.29 71.63,35.79 LED5.A
N$25  (via drill 0.33)
  Top 0.305: Q5.C 69.09,31.21 D5.A 68.36,32.48 v67.82,33.02
  Bottom 0.305: v67.82,33.02 67.82,26.67 RLY5.1
N$26
  Top 0.305: Q5.B R11.2
N$27
  Top 0.305: OP5.3 64.52,34.95 R11.1
N$28
  Top 0.305: R10.1 61.56,29.06 OP5.1
N$29
  Top 0.305: OP4.2 48.43,28.55 52.26,32.38 55.12,32.38 57.34,34.61 57.34,36.74 LED4.A
N$30
  Top 0.305: Q6.C 84.33,33.02 83.69,32.38 83.69,30.57 D6.A 83.6,27.21 RLY6.1
N$31
  Top 0.305: R13.2 83.36,35.71 Q6.B
N$32
  Top 0.305: OP6.3 78.44,34.95 R13.1
N$33  (via drill 0.33)
  Top 0.305: R12.1 v74.17,34.29 | v74.17,29.21 74.8,28.57 76.01,28.57 OP6.1
  Bottom 0.305: v74.17,34.29 v74.17,29.21
N$34  (via drill 0.33)
  Top 0.305: OP7.2 95.1,28.55 v95.12,28.57 | v103.06,32.38 103.06,36.74 LED7.A
  Bottom 0.305: v95.12,28.57 99.25,28.57 v103.06,32.38
N$35
  Top 0.305: Q7.C 99.57,33.02 98.84,32.29 D7.A 98.84,27.21 RLY7.1
N$36
  Top 0.305: Q7.B 97.01,34.46 R15.2
N$37
  Top 0.305: OP7.3 94.49,33.02 95.61,33.02 R15.1
N$38  (via drill 0.33)
  Top 0.305: R14.1 v89.41,33.02 | v90.04,28.57 91.25,28.57 OP7.1
  Bottom 0.305: v89.41,33.02 89.41,29.21 v90.04,28.57
N$39  (via drill 0.33)
  Top 0.305: OP8.2 111.61,28.55 v111.63,28.57 | v118.3,33.02 118.3,34.46 LED8.A
  Bottom 0.305: v111.63,28.57 113.85,28.57 v118.3,33.02
N$40
  Top 0.305: Q8.C 114.81,31.21 D8.A 114.08,27.21 RLY8.1
N$41
  Top 0.305: Q8.B 112.59,34.46 R17.2
N$42
  Top 0.305: OP8.3 110.24,34.95 R17.1
N$43  (via drill 0.33)
  Top 0.305: R16.1 61.3,66.19 v62.1,66.99 | v107.82,26.35 107.82,28.52 OP8.1
  Bottom 0.305: v62.1,66.99 88.46,66.99 94.8,60.64 103.06,60.64 107.51,56.2 107.51,26.67 v107.82,26.35
N$44
  Top 1.016: JP8.2 103.07,8.58 RLY7.3
N$45
  Top 1.016: RLY8.3 119.89,5.39 JP9.2
N$46
  Top 1.016: RLY7.4 97.03,5.08 JP8.1
N$47
  Top 1.016: RLY6.4 81.79,5.08 JP7.1
N$48
  Top 1.016: JP7.2 87.83,8.58 RLY6.3
N$49
  Top 1.016: RLY5.3 74.17,8.89 72.9,7.62 72.9,2.85 JP6.2
N$50
  Top 1.016: JP6.1 69.09,10.16 RLY5.4
N$51
  Top 1.016: JP9.1 113.54,11.43 RLY8.4
N$52
  Top 1.016: RLY4.3 58.93,4.12 JP5.2
N$53
  Top 1.016: RLY4.4 51.31,5.08 JP5.1
N$54
  Top 1.016: RLY3.3 43.69,7.62 42.42,6.35 42.42,2.85 JP4.2
N$55
  Top 1.016: RLY3.4 36.07,5.08 JP4.1
N$56
  Top 1.016: RLY2.3 28.45,7.62 27.18,6.35 27.18,2.85 JP3.2
N$57
  Top 1.016: RLY2.4 20.83,8.89 23.37,6.35 JP3.1
N$58
  Top 1.016: RLY1.3 13.21,7.62 11.94,6.35 11.94,2.85 JP2.2
N$59
  Top 1.016: RLY1.4 5.59,5.08 JP2.1
N$60
  Top 0.305: U19.8 U19.7 88.77,58.42 89.73,59.37 91.95,59.37 93.54,57.78 116.27,57.78 118.43,59.94 118.43,64.9 JP12.2
N$61
  Top 0.305: U19.6 U19.5 119,57.23 JP13.2
N$62
  Top 0.406: U17.PG 23.44,55.8 24.64,54.61 24.64,52.86 R18.1
N$63  (via drill 0.33)
  Top 0.305: U1.26 51.85,46.58 v51.31,46.04
  Bottom 0.305: v51.31,46.04 10.35,46.04 5.91,50.48 5.91,55.94 JP14.2
N$64
  Top 0.406: 3.3.C 60.12,70.89 R21.1
N$65  (via drill 0.33)
  Top 0.406: C11.1 v11.94,57.91 | v17.46,55.44 18.55,55.44 U17.BST
  Bottom 0.406: v11.94,57.91 11.94,57.53 14.03,55.44 v17.46,55.44
N$67
  Top 0.406: 5V.C 31.22,62.15 R22.2
RELAY1  (via drill 0.33)
  Top 0.305: R2.2 50.83,43.33 52.26,44.77 v53.85,44.77 | v57.34,44.77 57.66,44.77 57.98,45.09 57.98,49.1 U1.1
  Bottom 0.305: v53.85,44.77 v57.34,44.77
RELAY2
  Top 0.305: U1.2 60.27,50.07 R4.2
RELAY3
  Top 0.305: U1.9 56.65,59.31 57.66,60.33 60.2,60.33 61.15,61.28 61.47,61.28 62.1,61.91 66.38,61.91 R6.2
RELAY4
  Top 0.305: R8.2 62.59,63.35 61.15,61.91 60.83,61.91 59.88,60.96 57.34,60.96 55.75,59.37 55.75,56.46 U1.10
RELAY5
  Top 0.305: R16.2 60.2,62.23 59.56,61.59 57.02,61.59 55.12,59.69 55.12,56.43 U1.11
RELAY6  (via drill 0.33)
  Top 0.305: U1.12 54.25,57.7 v54.16,57.78 | v57.66,32.7 59.4,32.7 R10.2
  Bottom 0.305: v54.16,57.78 52.58,57.78 51.56,56.77 51.56,53.91 52.13,53.34 52.13,52.01 51.62,51.5 51.62,47.94 52.58,46.99 52.58,37.78 v57.66,32.7
RELAY7  (via drill 0.33)
  Top 0.305: U1.13 53.45,55.01 v53.53,54.93 | v74.17,47.94 R12.2
  Bottom 0.305: v53.53,54.93 53.53,53.72 53.85,53.4 53.85,48.9 54.48,48.26 57.34,48.26 57.98,47.62 73.85,47.62 v74.17,47.94
RELAY8  (via drill 0.33)
  Top 0.305: U1.14 52.65,55 v52.58,54.93 | v86.23,43.81 88.92,43.81 R14.2
  Bottom 0.305: v52.58,54.93 52.58,53.91 53.21,53.28 53.21,48.58 54.16,47.62 57.02,47.62 57.66,46.99 83.06,46.99 v86.23,43.81
RESET  (via drill 0.33)
  Top 0.305: v54.74,49.53 54.25,49 U1.29 54.25,46.12 53.53,45.4 51.94,45.4 51.62,45.09 48.29,45.09 R1.1
  Bottom 0.305: v54.74,49.53 54.74,52.32 55.18,52.77 55.18,52.96 55.12,63.5 J1.5
RFID  (via drill 0.33)
  Top 0.305: U1.25 50.19,47.78 v49.4,46.99
  Bottom 0.305: v49.4,46.99 10.35,46.99 6.54,50.8 6.54,56.07 5.02,57.59 5.02,60.13 JP14.1
ROCKLIGHTS  (via drill 0.33)
  Top 0.305: U1.23 51.28,50.07 v52.39,51.24 | R20.2 83.06,45.57 v83.06,45.4 83.38,45.09 88.77,45.09 89.41,45.72 89.41,48.26 88.77,48.9 U19.2
  Bottom 0.305: v52.39,51.24 52.39,48.45 53.85,46.99 56.71,46.99 57.34,46.35 82.1,46.35 v83.06,45.4
RX  (via drill 0.33)
  Top 0.305: U1.30 55.05,45.16 56.39,43.81 JP15.2 | BLUETOOTH.4 80.52,52.07 78.3,49.85 78.3,46.99 77.34,46.04 77.34,41.91 v76.71,41.27
  Bottom 0.305: v76.71,41.27 58.29,41.27 JP15.2
RX-JUMP  (via drill 0.33)
  Top 0.305: v105.92,41.59 111.32,46.99 JP11.1
  Bottom 0.305: JP15.1 53.85,41.91 55.12,40.64 76.07,40.64 76.39,40.32 104.65,40.32 v105.92,41.59
SCK  (via drill 0.33)
  Top 0.305: U1.17 49.55,61.75 v50.04,62.23
  Bottom 0.305: v50.04,62.23 52.58,62.23 53.85,63.5 J1.3
SCL  (via drill 0.33)
  Top 0.305: U1.28 53.45,49.51 54.42,50.48 v56.52,50.48 | v102.05,59.44 104.71,62.1 104.71,69.79 I2C/IO.4
  Bottom 0.305: v56.52,50.48 57.28,50.48 58.61,49.15 73.09,49.15 73.47,49.53 92.71,49.53 101.66,58.48 101.66,59.05 v102.05,59.44
SDA  (via drill 0.33)
  Top 0.305: U1.27 52.65,49.66 54.23,51.24 55.37,51.24 v55.56,51.44 | v100.9,59.82 102.05,60.96 102.05,69.79 I2C/IO.3
  Bottom 0.305: v55.56,51.44 57.09,51.44 58.8,49.72 72.9,49.72 73.28,50.1 92.33,50.1 100.9,58.67 v100.9,59.82
SW
  pour Top (no thermals): 18.92,60.96 18.92,66.04 8.13,66.04 8.13,60.96
TX  (via drill 0.33, 0.6)
  Top 0.305: U1.31 55.85,46.26 v56.39,45.72 | BLUETOOTH.5 83.06,53.34 79.25,49.53 79.25,46.99 78.3,46.04 v78.3,45.4
  Bottom 0.305: v56.39,45.72 60.2,45.72 61.47,44.45 JP15.4 64.01,45.72 76.39,45.72 76.71,45.4 v78.3,45.4
TX-JUMP  (via drill 0.33)
  Top 0.305: JP15.3 58.93,41.59 v57.02,39.69 | v106.24,43.5 106.87,43.5 111,47.62 117.98,47.62 JP11.2
  Bottom 0.305: v57.02,39.69 57.66,39.69 57.98,40.01 75.76,40.01 76.07,39.69 105.92,39.69 106.87,40.64 106.87,42.86 v106.24,43.5

### Text on the board
tPlace: Jeep Wireless System v0.1 | Designed by: www.RossRobotics.com | 19 | 22 | 32 | SCL | SDA